# EAGLE schematic avr (EAGLE 6.5.0)
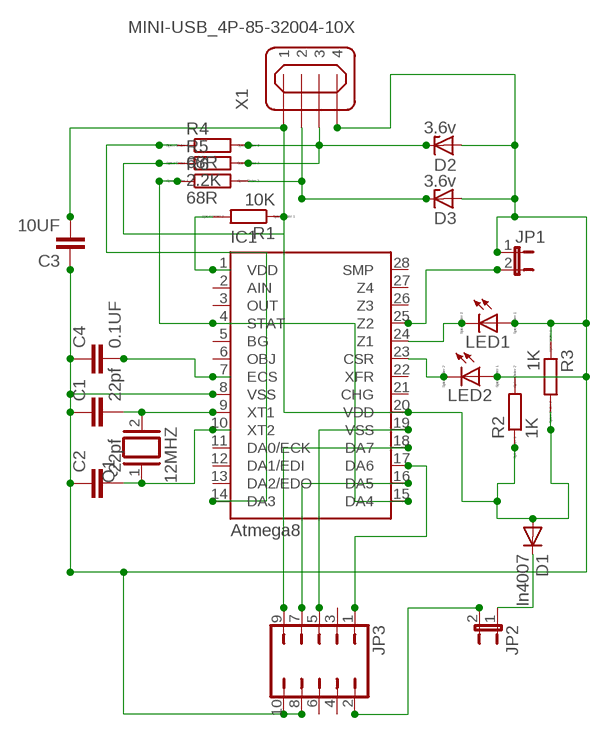
[diagram p0: schematic, sheet 1]

## Parts
C1  22pf  C2,5-3  [C2.5-3]
C2  22pf  C2,5-3  [C2.5-3]
C3  10UF  C2,5-3  [C2.5-3]
C4  0.1UF  C2,5-3  [C2.5-3]
D1  In4007  1N5060GP  [DO15-12]
D2  3.6v  1N4728  [DO41Z10]
D3  3.6v  1N4728  [DO41Z10]
IC1  Atmega8  QT9701BD  [DIL28-3]
JP1  JP1E  [JP1]
JP2  JP1E  [JP1]
JP3  JP5Q  [JP5Q]
LED1  LED_ELD260  [LED_LD260]
LED2  LED_ELD260  [LED_LD260]
Q1  12MHZ  XTAL/S  [QS]
R1  10K  R0204/7  [0204/7]
R2  1K  R0204/7  [0204/7]
R3  1K  R0204/7  [0204/7]
R4  68R  R0204/7  [0204/7]
R5  2.2K  R0204/7  [0204/7]
R6  68R  R0204/7  [0204/7]
X1  MINI-USB_4P-85-32004-10X  [85-32004-10X]

## Nets
N$1: C1.2 IC1.9(XT1) Q1.2
N$2: C2.2 IC1.10(XT2) Q1.1
N$3: D2.C R4.2 R5.2 X1.3
N$4: IC1.23(CSR) LED2.K(C)
N$5: IC1.24(Z1) LED1.K(C)
N$6: D3.C R6.2 X1.2
N$7: C3.2 D1.A IC1.20(VDD) R1.1 R2.1 R3.2 R5.1 X1.1
N$8: D1.C JP2.1
N$9: IC1.25(Z2) JP1.2
N$10: IC1.17(DA6) JP3.1
N$11: IC1.14(DA3) R4.1
N$12: IC1.4(STAT) IC1.15(DA4) R6.1
N$13: C4.2 IC1.7(ECS)
N$14: C1.1 C2.1 C3.1 C4.1 D2.A D3.A IC1.8(VSS) JP1.1 JP3.8 JP3.10 LED1.A LED2.A R2.2 R3.1 X1.4
N$15: JP2.2 JP3.2
N$16: IC1.16(DA5) JP3.7
N$17: IC1.19(VSS) JP3.5
N$18: IC1.18(DA7) JP3.9
N$19: IC1.1(VDD) R1.2
Unconnected: IC1.2(AIN) IC1.3(OUT) IC1.5(BG) IC1.6(OBJ) IC1.11(DA0/ECK) IC1.12(DA1/EDI) IC1.13(DA2/EDO) IC1.21(CHG) IC1.22(XFR) IC1.26(Z3) IC1.27(Z4) IC1.28(SMP) JP3.3 JP3.4 JP3.6

## Library data of the parts
C1-C4 = capacitor-wima:C: CAPACITOR naming: grid - package width
D1 = diode:1N5060GP: DIODE controlled avalanche rectifier
D2 D3 = diode:1N4728: Z DIODE 3.3 V, 1W, 5 percent
IC1 = quantum-research-group:QT9701B: Charge-Transfer Capacitance Sensor IC Source: http://data.qprox.com/downloads/datasheets/qt9701b.pdf; OC_FARNELL: unknown; OC_NEWARK: unknown
JP1 JP2 = jumper:JP1E: JUMPER
JP3 = jumper:JP5Q: JUMPER
LED1 LED2 = eagle-ltspice:LED_E: LED Source: http://www.osram.convergy.de Source: www.luxeon.com Source: www.kingbright.com; SPICEMODEL: NONE; SPICEPREFIX: D; SPICETYPE: diode
Q1 = special:XTAL/S: CRYSTAL
R1-R6 = eagle-ltspice:R: RESISTOR, European symbol; SPICEMODEL: NONE; SPICEPREFIX: R
X1 = con-cypressindustries:MINI-USB_4P-: MINI USB 4 Pol. Source: www.cypressindustries.com; OC_FARNELL: unknown; OC_NEWARK: unknown